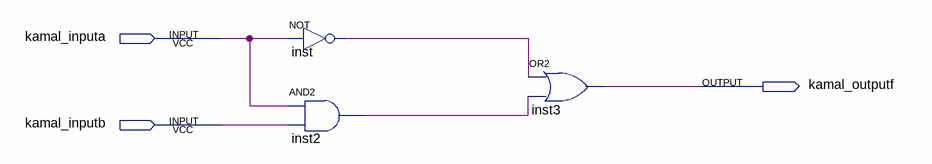
[diagram p0: schematic sheet]
// Quartus schematic kamal_simpleCircuit.bdf as structural Verilog: 3 symbols, 3 pins
module kamal_simpleCircuit (
  input  kamal_inputa,
  input  kamal_inputb,
  output kamal_outputf
);

  wire inst2_out, inst_out;

  not inst (inst_out, kamal_inputa);
  and inst2 (inst2_out, kamal_inputa, kamal_inputb);
  or inst3 (kamal_outputf, inst_out, inst2_out);
endmodule
